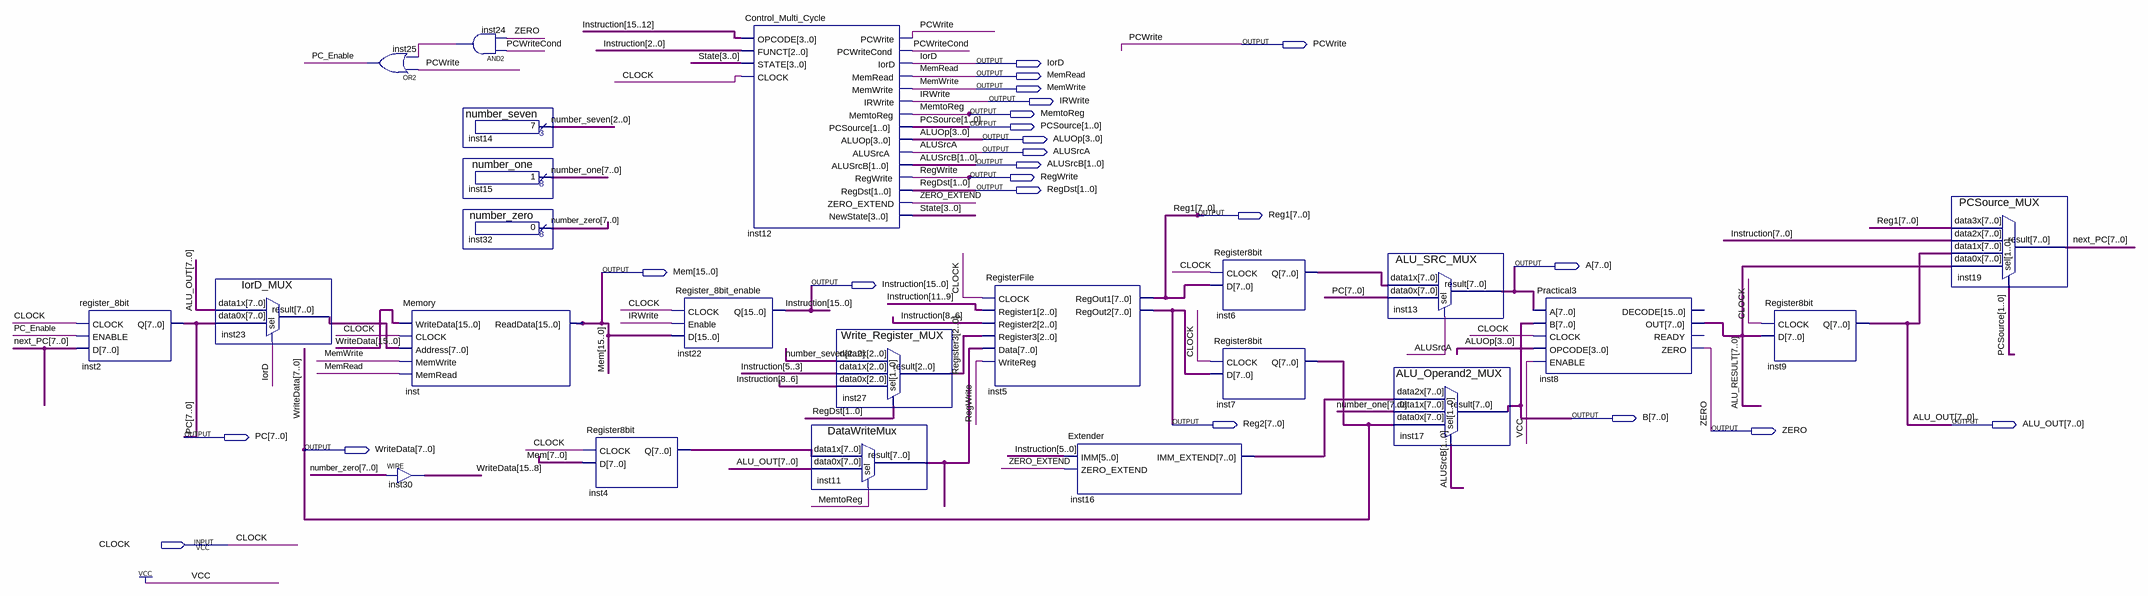
[diagram p0: schematic sheet]
// Quartus schematic MIPS_CPU_MULTI_CYCLE.bdf as structural Verilog: 23 symbols, 23 pins
module MIPS_CPU_MULTI_CYCLE (
  input  CLOCK,
  output PCWrite,
  output IorD,
  output MemRead,
  output MemWrite,
  output IRWrite,
  output MemtoReg,
  output [1:0] PCSource,
  output [3:0] ALUOp,
  output ALUSrcA,
  output [1:0] ALUSrcB,
  output RegWrite,
  output [1:0] RegDst,
  output [7:0] Reg1,
  output [7:0] A,
  output [15:0] Mem,
  output [15:0] Instruction,
  output [7:0] B,
  output [7:0] Reg2,
  output [7:0] ALU_OUT,
  output ZERO,
  output [7:0] PC,
  output [15:0] WriteData
);

  wire inst24_out, PC_Enable, PCWriteCond, ZERO_EXTEND;
  wire [2:0] number_seven, Register3;
  wire [3:0] State;
  wire [7:0] ALU_RESULT, inst4_q, inst6_q, inst11_result, inst16_imm_extend, inst23_result, next_PC,
       number_one, number_zero;

  register_8bit inst2 (.CLOCK(CLOCK), .ENABLE(PC_Enable), .D(next_PC), .Q(PC));
  IorD_MUX inst23 (.data1x(ALU_OUT), .data0x(PC), .sel(IorD), .result(inst23_result));
  or inst25 (PC_Enable, PCWrite, inst24_out);
  Memory inst (
    .WriteData(WriteData), .CLOCK(CLOCK), .Address(inst23_result), .MemWrite(MemWrite), .MemRead(MemRead),
    .ReadData(Mem));
  assign WriteData[15:8] = number_zero;  // WIRE inst30
  and inst24 (inst24_out, PCWriteCond, ZERO);
  number_seven inst14 (.result(number_seven));
  number_one inst15 (.result(number_one));
  number_zero inst32 (.result(number_zero));
  Register8bit inst4 (.CLOCK(CLOCK), .D(Mem[7:0]), .Q(inst4_q));
  Register_8bit_enable inst22 (.CLOCK(CLOCK), .Enable(IRWrite), .D(Mem), .Q(Instruction));
  Control_Multi_Cycle inst12 (
    .OPCODE(Instruction[15:12]), .FUNCT(Instruction[2:0]), .STATE(State), .CLOCK(CLOCK), .PCWrite(PCWrite),
    .PCWriteCond(PCWriteCond), .IorD(IorD), .MemRead(MemRead), .MemWrite(MemWrite), .IRWrite(IRWrite),
    .MemtoReg(MemtoReg), .PCSource(PCSource), .ALUOp(ALUOp), .ALUSrcA(ALUSrcA), .ALUSrcB(ALUSrcB),
    .RegWrite(RegWrite), .RegDst(RegDst), .ZERO_EXTEND(ZERO_EXTEND), .NewState(State));
  Write_Register_MUX inst27 (
    .data2x(number_seven), .data1x(Instruction[5:3]), .data0x(Instruction[8:6]), .sel(RegDst),
    .result(Register3));
  DataWriteMux inst11 (.data1x(inst4_q), .data0x(ALU_OUT), .sel(MemtoReg), .result(inst11_result));
  RegisterFile inst5 (
    .CLOCK(CLOCK), .Register1(Instruction[11:9]), .Register2(Instruction[8:6]), .Register3(Register3),
    .Data(inst11_result), .WriteReg(RegWrite), .RegOut1(Reg1), .RegOut2(Reg2));
  Extender inst16 (.IMM(Instruction[5:0]), .ZERO_EXTEND(ZERO_EXTEND), .IMM_EXTEND(inst16_imm_extend));
  Register8bit inst6 (.CLOCK(CLOCK), .D(Reg1), .Q(inst6_q));
  Register8bit inst7 (.CLOCK(CLOCK), .D(Reg2), .Q(WriteData[7:0]));
  ALU_SRC_MUX inst13 (.data1x(inst6_q), .data0x(PC), .sel(ALUSrcA), .result(A));
  ALU_Operand2_MUX inst17 (
    .data2x(inst16_imm_extend), .data1x(number_one), .data0x(WriteData[7:0]), .sel(ALUSrcB), .result(B));
  Practical3 inst8 (
    .A(A), .B(B), .CLOCK(CLOCK), .OPCODE(ALUOp), .ENABLE(1'b1), .OUT(ALU_RESULT), .ZERO(ZERO));  // open: DECODE, READY
  Register8bit inst9 (.CLOCK(CLOCK), .D(ALU_RESULT), .Q(ALU_OUT));
  PCSource_MUX inst19 (
    .data3x(Reg1), .data2x(Instruction[7:0]), .data1x(ALU_OUT), .data0x(ALU_RESULT), .sel(PCSource),
    .result(next_PC));
endmodule
